# EasyEDA schematic 1-Schematic_Power Board PCB.json
TITLE: Sheet_1; REV: 1.0; Date: 2022-07-08; Sheet: 1/1; Drawn By: PentBeear; Company: Your Company
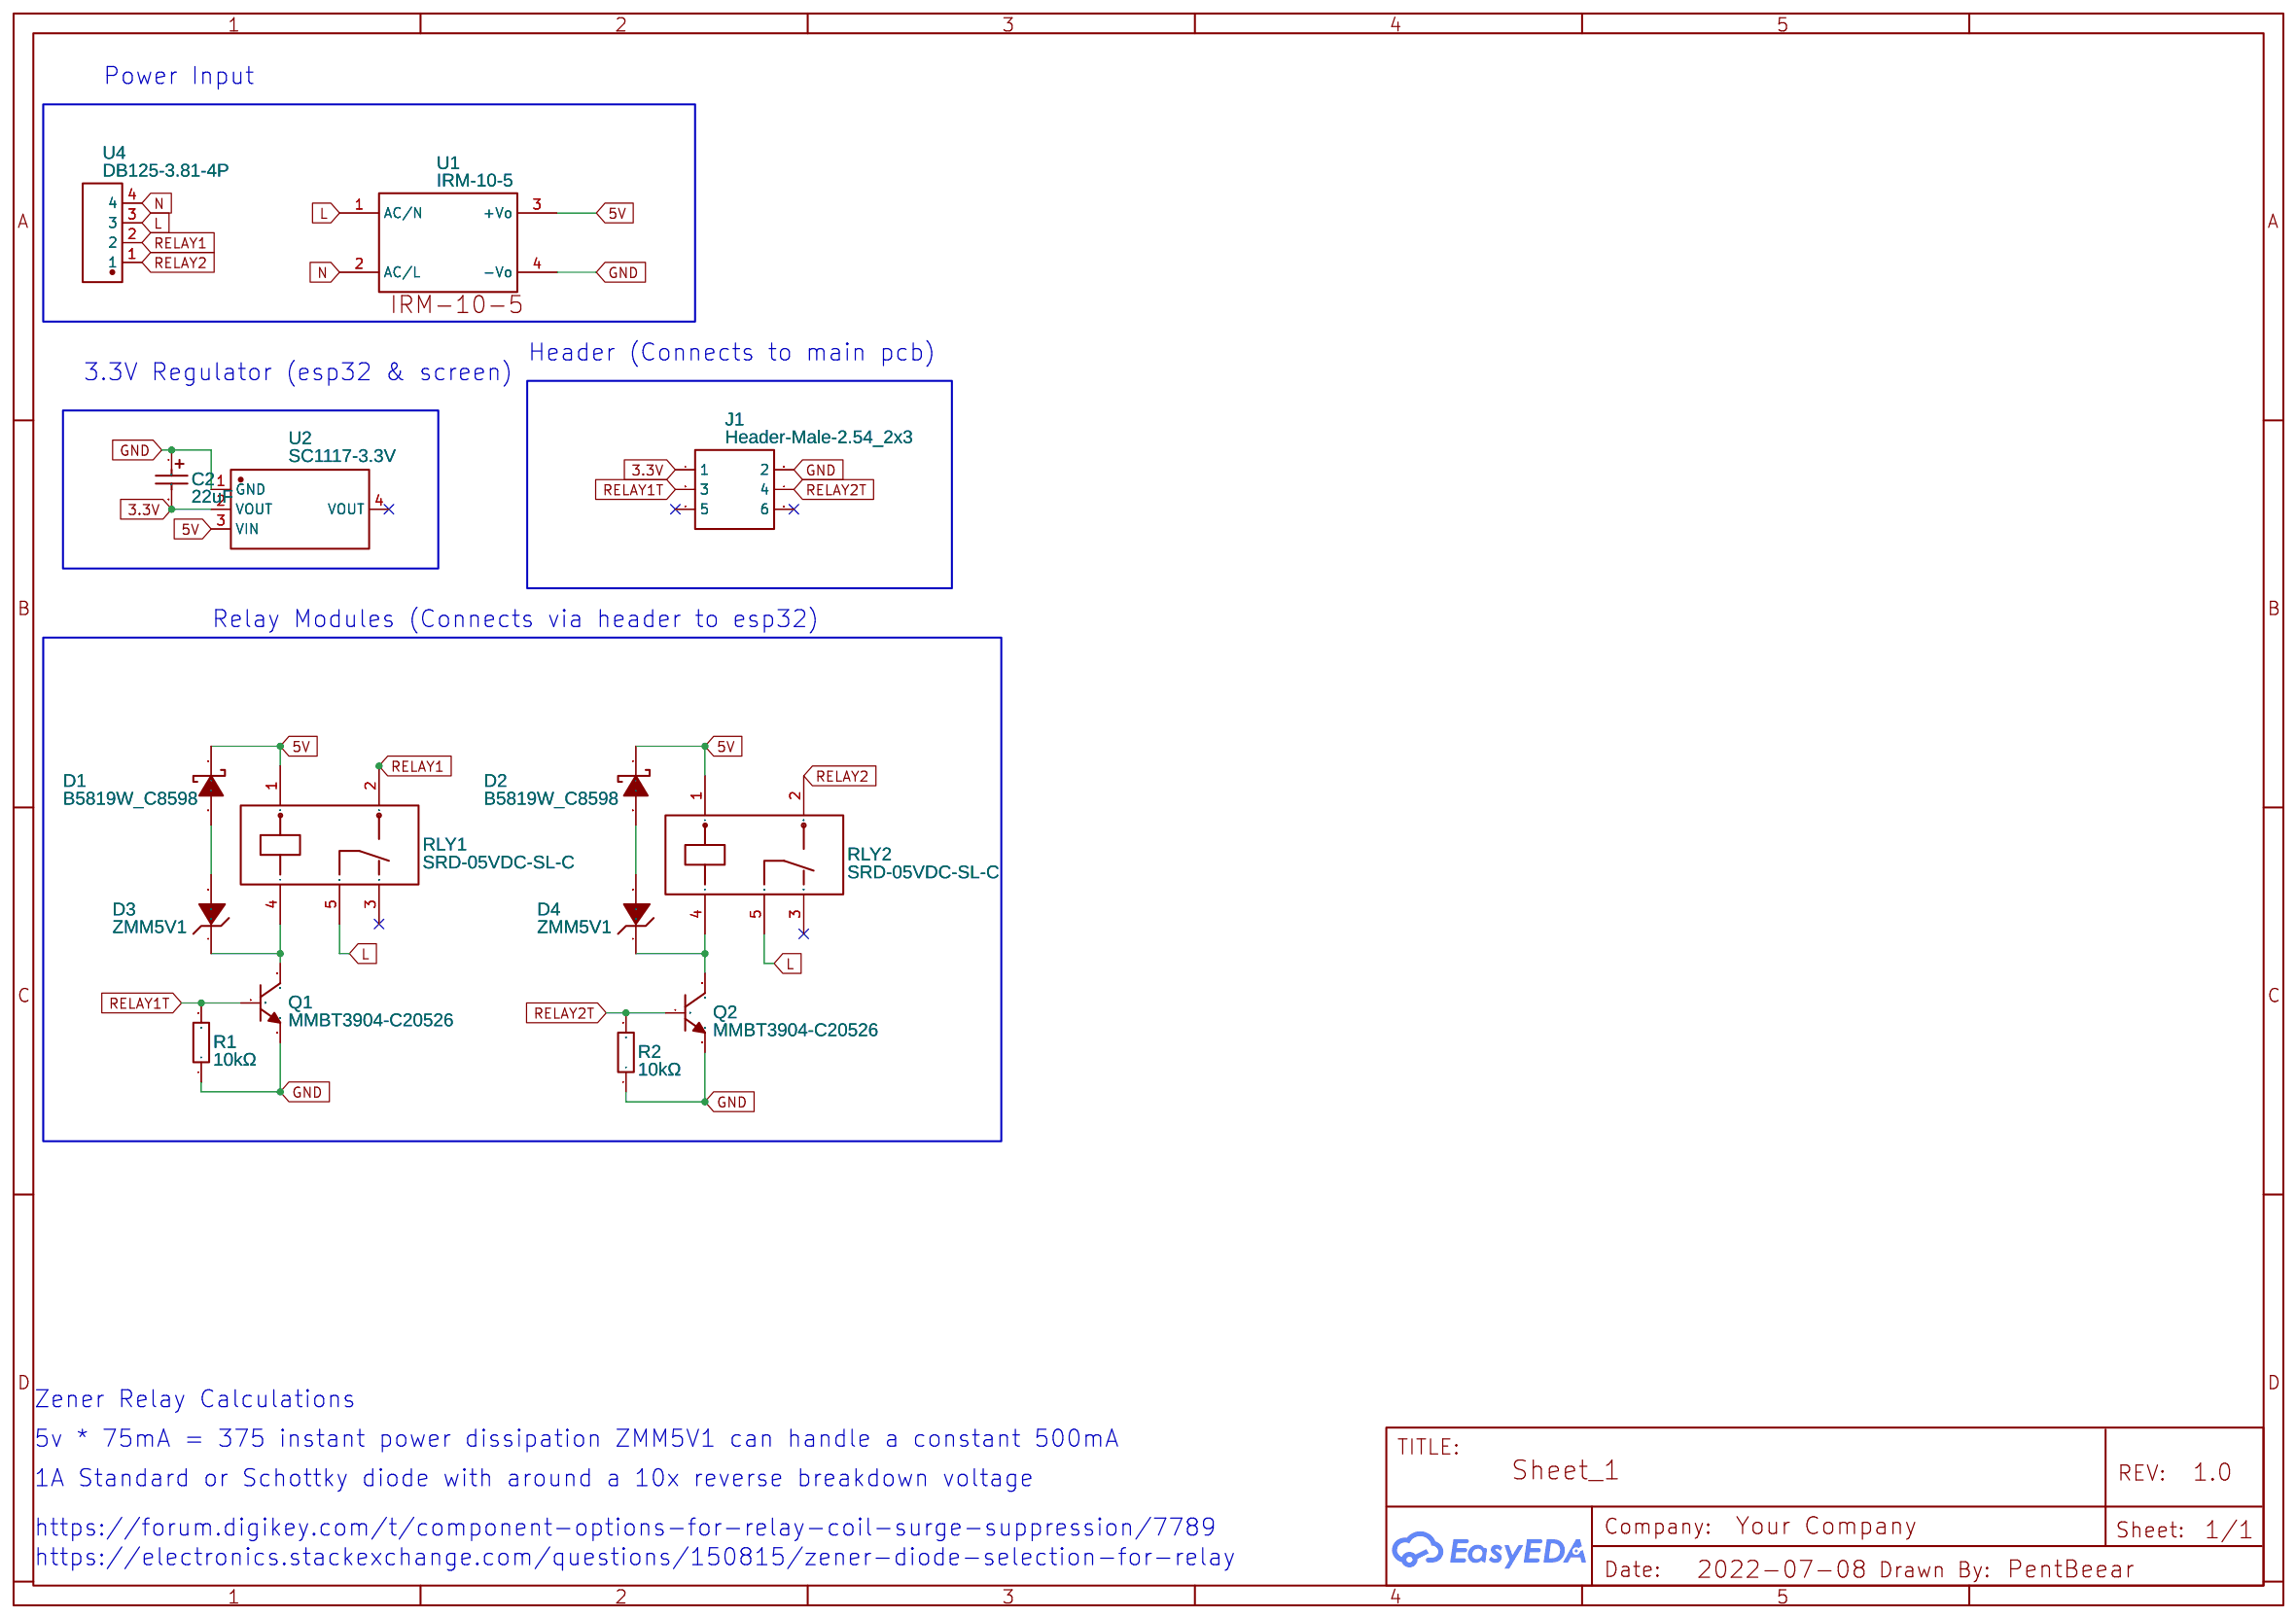
[diagram p0: schematic sheet]

## Parts
C2  22uF  [CAP-SMD_L3.5-W2.8-R-RD]
D1  B5819W_C8598  [SOD-123_L2.7-W1.6-LS3.7-RD-1]
D2  B5819W_C8598  [SOD-123_L2.7-W1.6-LS3.7-RD-1]
D3  ZMM5V1  [LL-34_L3.5-W1.5-RD]
D4  ZMM5V1  [LL-34_L3.5-W1.5-RD]
J1  Header-Male-2.54_2x3  [HDR-TH_6P-P2.54-V-M-R2-C3-S2.54-1]
Q1  MMBT3904-C20526  [SOT-23-3_L2.9-W1.3-P1.90-LS2.4-BR]
Q2  MMBT3904-C20526  [SOT-23-3_L2.9-W1.3-P1.90-LS2.4-BR]
R1  10kΩ  [R0805]
R2  10kΩ  [R0805]
RLY1  SRD-05VDC-SL-C  [RELAY-TH_SRD-XXVDC-XL-C]
RLY2  SRD-05VDC-SL-C  [RELAY-TH_SRD-XXVDC-XL-C]
U1  IRM-10-5  [IRM-10-5]
U2  SC1117-3.3V  [SOT-223_L6.5-W3.5-P2.30-LS7.0-BR]
U4  DB125-3.81-4P  [CONN-TH_DB125-3.81-4P]

## Library data of the parts
C2 = TAJB226K016RNJ: Supplier: LCSC; Manufacturer: AVX; Supplier Part: C8020; JLCPCB Part Class: Extended Part
D1 D2 = B5819W_C8598: Supplier: LCSC; Manufacturer: CJ; Manufacturer Part: B5819W; Supplier Part: C8598; JLCPCB Part Class: Basic Part
D3 D4 = ZMM5V1: Supplier: LCSC; Manufacturer: SEMTECH; Supplier Part: C8061; JLCPCB Part Class: Extended Part
J1 = Header-Male-2.54_2x3: Supplier: LCSC; Manufacturer: BOOMELE; Supplier Part: C65114; JLCPCB Part Class: Extended Part
Q1 Q2 = MMBT3904-C20526: Supplier: LCSC; Manufacturer: CJ; Manufacturer Part: MMBT3904; Supplier Part: C20526; Contributor: 立创EDA官方封装库; JLCPCB Part Class: Basic Part
R1 R2 = RS-05K1002FT: Supplier: LCSC; Manufacturer: FH; Supplier Part: C115309; Resistance (Ohms): 10K; JLCPCB Part Class: Extended Part
RLY1 RLY2 = SRD-05VDC-SL-C: Supplier: LCSC; Manufacturer: SONGLE; Supplier Part: C35449; JLCPCB Part Class: Extended Part
U1 = IRM-10-5: Manufacturer: MEAN WELL; Supplier Part: NO; Contributor: PentBeear
U2 = SC1117-3.3V: Supplier: LCSC; Manufacturer: FM; Contributor: LCSC; Supplier Part: C173386; JLCPCB Part Class: Extended Part
U4 = DB125-3.81-4P: Supplier: LCSC; Supplier Part: C395880; Manufacturer: DIBO; Contributor: LCSC; JLCPCB Part Class: Extended Part

## Nets
3.3V: C2.2 J1.1 U2.2(VOUT)
5V: D1.1(-) D2.1(-) RLY1.1 RLY2.1 U1.3(+Vo) U2.3(VIN)
GND: C2.1 J1.2 Q1.2(E) Q2.2(E) R1.1 R2.1 U1.4(-Vo) U2.1(GND)
L: RLY1.5 RLY2.5 U1.1(AC/N) U4.3
N: U1.2(AC/L) U4.4
RELAY1: RLY1.2 U4.2
RELAY1T: J1.3 Q1.1(B) R1.2
RELAY2: RLY2.2 U4.1
RELAY2T: J1.4 Q2.1(B) R2.2
Net-(D1-2): D1.2(+) D3.2(A)
Net-(D2-2): D2.2(+) D4.2(A)
Net-(D3-1): D3.1(C) Q1.3(C) RLY1.4
Net-(D4-1): D4.1(C) Q2.3(C) RLY2.4

Not connected (* = marked no-connect by the designer): J1 5* 6*; RLY1 3*; RLY2 3*; U2 4(VOUT)*

## Notes on the sheet
- Power Input
- Header (Connects to main pcb)
- 3.3V Regulator (esp32 & screen)
- Relay Modules (Connects via header to esp32)
- Zener Relay Calculations
- 5v * 75mA = 375 instant power dissipation ZMM5V1 can handle a constant 500mA
- 1A Standard or Schottky diode with around a 10x reverse breakdown voltage
- https://forum.digikey.com/t/component-options-for-relay-coil-surge-suppression/7789
- https://electronics.stackexchange.com/questions/150815/zener-diode-selection-for-relay
